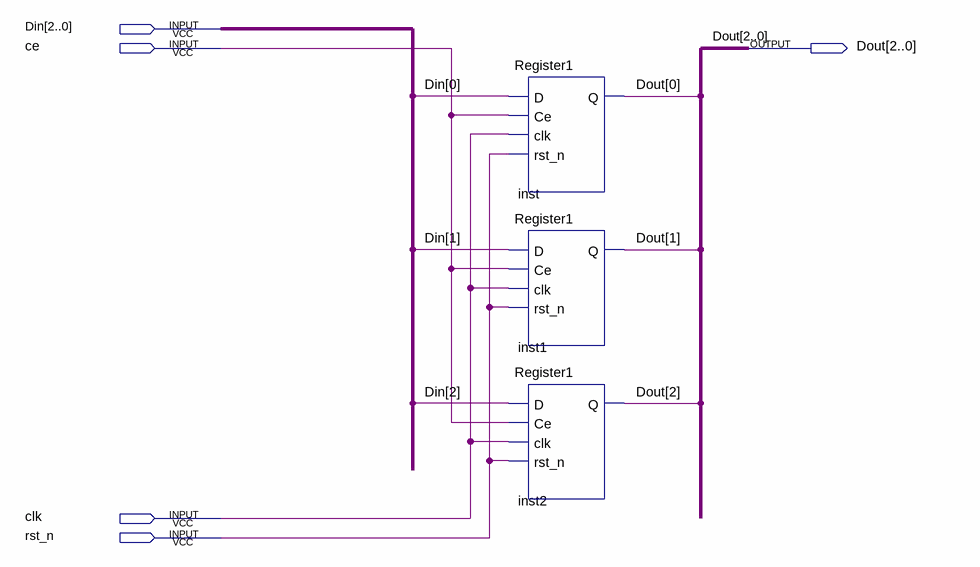
[diagram p0: schematic sheet]
// Quartus schematic Register3.bdf as structural Verilog: 3 symbols, 5 pins
module Register3 (
  input  [2:0] Din,
  input  ce,
  input  clk,
  input  rst_n,
  output [2:0] Dout
);

  Register1 inst (.D(Din[0]), .Ce(ce), .clk(clk), .rst_n(rst_n), .Q(Dout[0]));
  Register1 inst1 (.D(Din[1]), .Ce(ce), .clk(clk), .rst_n(rst_n), .Q(Dout[1]));
  Register1 inst2 (.D(Din[2]), .Ce(ce), .clk(clk), .rst_n(rst_n), .Q(Dout[2]));
endmodule
